# EAGLE schematic Schema_Arduino_Blinky (EAGLE 7.3.0)
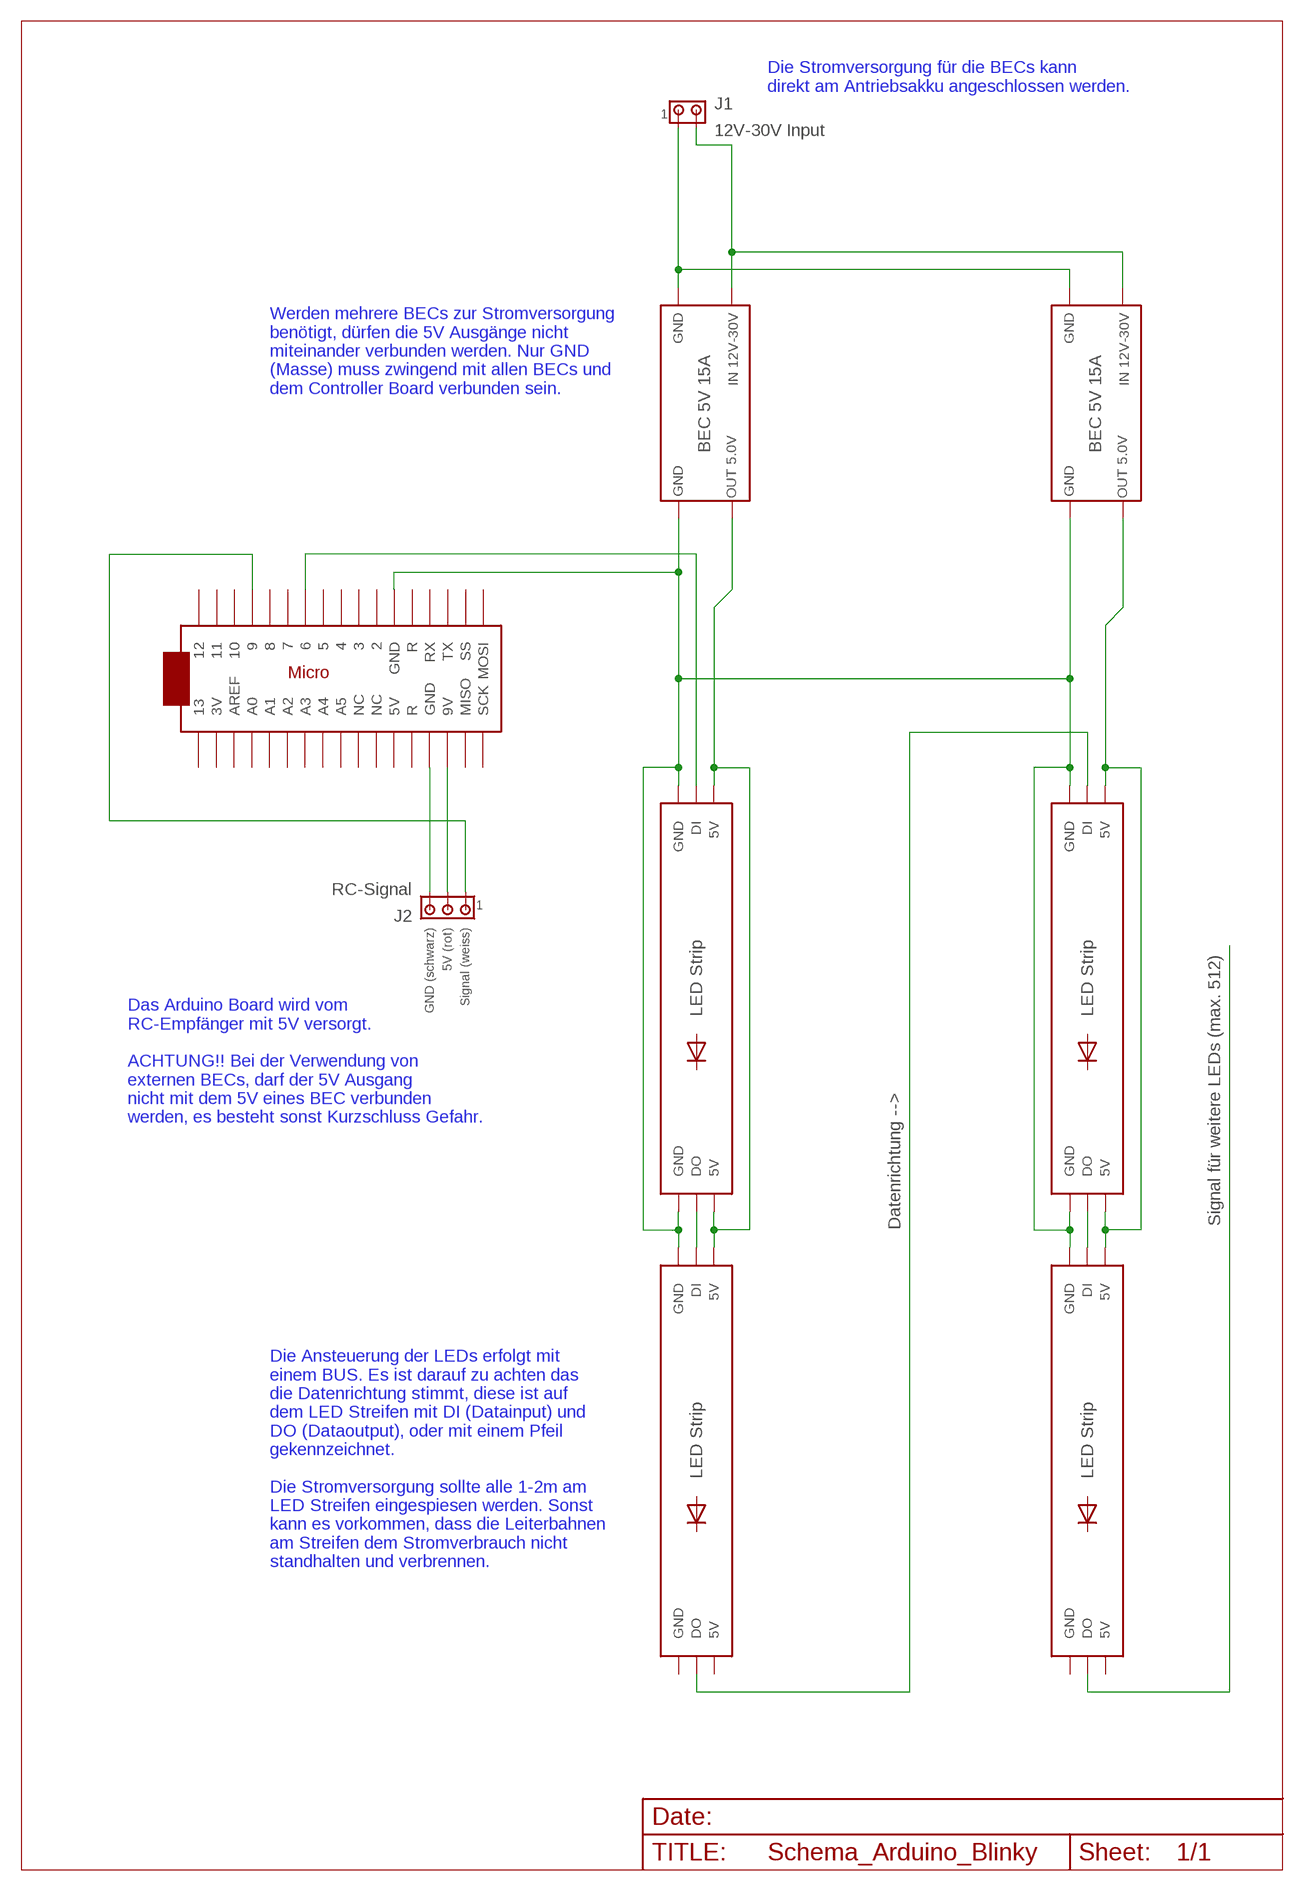
[diagram p0: schematic, sheet 1]

## Parts
J1  12V-30V Input  350428-1  [350428-1]
J2  RC-Signal  350429-1  [350429-1]
U$1  ARDUINOMICRO  [ARDUINOMICRO]

## Nets
N$1: U$1.P$21(GND)
N$4: J1.1
N$6: J2.3 U$1.P$12(GND)
N$7: J2.2 U$1.P$20(9V)
N$8: J2.1 U$1.P$4
N$9: J1.2
N$10: U$1.P$7
Unconnected: U$1.P$1 U$1.P$2 U$1.P$3 U$1.P$5 U$1.P$6 U$1.P$8 U$1.P$9 U$1.P$10 U$1.P$11 U$1.P$13(R) U$1.P$14(RX) U$1.P$15(TX) U$1.P$16(SS) U$1.P$17(MOSI) U$1.P$18(SCK) U$1.P$19(MISO) U$1.P$22(R) U$1.P$23(5V) U$1.P$24(NC) U$1.P$25(NC) U$1.P$26(A5) U$1.P$27(A4) U$1.P$28(A3) U$1.P$29(A2) U$1.P$30(A1) U$1.P$31(A0) U$1.P$32(AREF) U$1.P$33(3V) U$1.P$34

## Notes on the sheet
- Die Stromversorgung für die BECs kann
  direkt am Antriebsakku angeschlossen werden.
- GND | IN 12V-30V | GND | IN 12V-30V
- BEC 5V 15A | BEC 5V 15A
- Werden mehrere BECs zur Stromversorgung
  benötigt, dürfen die 5V Ausgänge nicht
  miteinander verbunden werden. Nur GND
  (Masse) muss zwingend mit allen BECs und
  dem Controller Board verbunden sein.
- OUT 5.0V | OUT 5.0V
- GND | GND
- GND | DI | 5V | GND | DI | 5V
- GND (schwarz) | 5V (rot) | Signal (weiss)
- LED Strip | LED Strip
- Das Arduino Board wird vom 
  RC-Empfänger mit 5V versorgt.
  
  ACHTUNG!! Bei der Verwendung von
  externen BECs, darf der 5V Ausgang
  nicht mit dem 5V eines BEC verbunden
  werden, es besteht sonst Kurzschluss Gefahr.
- GND | DO | 5V | GND | DO | 5V
- Datenrichtung --> | Signal für weitere LEDs (max. 512)
- GND | DI | 5V | GND | DI | 5V
- LED Strip | LED Strip
- Die Ansteuerung der LEDs erfolgt mit
  einem BUS. Es ist darauf zu achten das
  die Datenrichtung stimmt, diese ist auf
  dem LED Streifen mit DI (Datainput) und
  DO (Dataoutput), oder mit einem Pfeil
  gekennzeichnet.
  
  Die Stromversorgung sollte alle 1-2m am
  LED Streifen eingespiesen werden. Sonst
  kann es vorkommen, dass die Leiterbahnen
  am Streifen dem Stromverbrauch nicht
  standhalten und verbrennen.
- GND | DO | 5V | GND | DO | 5V

## Library data of the parts
J1 = con-amp:350428-1: Universal MATE-N-LOK .250" Centerline, 600 V, 19 - 36 A max Source: http://catalog.tycoelectronics.com/ .. ENG_CD_350428_Y.pdf
J2 = con-amp:350429-1: Universal MATE-N-LOK .250" Centerline, 600 V, 19 - 36 A max Source: http://catalog.tycoelectronics.com/ .. ENG_CD_350429_Y.pdf
U$1 = adafruit:ARDUINOMICRO